# EAGLE design LTC4156Shield (EAGLE 7.4.0)
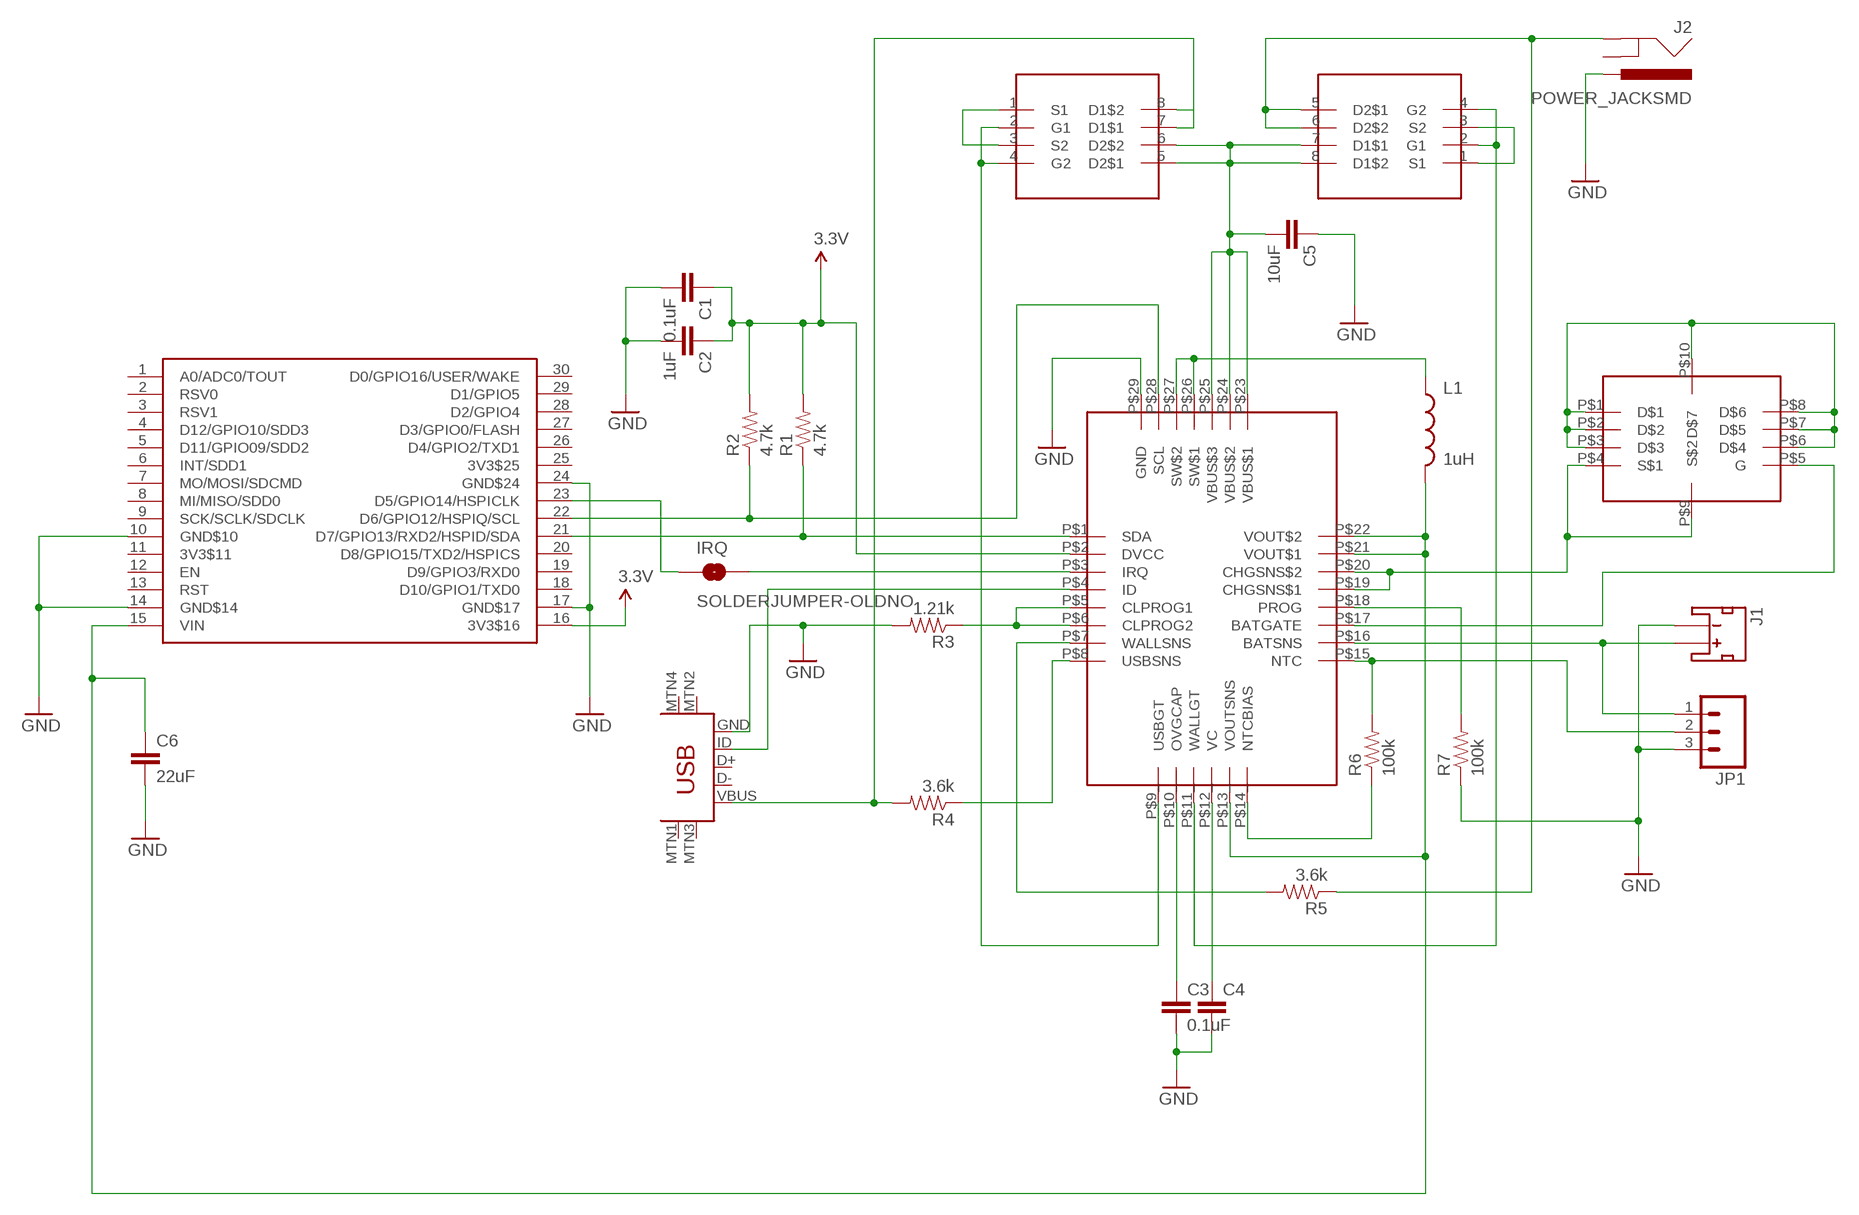
[diagram p0: schematic, sheet 1]

## Parts
C1  0.1uF  CAP0402-CAP  [0402-CAP]
C2  1uF  CAP0402-CAP  [0402-CAP]
C3  0.1uF  CAP0402-CAP  [0402-CAP]
C4  CAP0805  [0805]
C5  10uF  CAP0402-CAP  [0402-CAP]
C6  22uF  CAP0402-CAP  [0402-CAP]
IRQ  SOLDERJUMPER-OLDNO  [SJ_2S-NO]
J1  JST_2MM_MALE  [JST-2-SMD]
J2  POWER_JACKSMD  [POWER_JACK_SMD]
JP1  M03  [JST-3-SMD]
L1  1uH  INDUCTOR0805  [0805]
R1  4.7k  RESISTOR0402-RES  [0402-RES]
R2  4.7k  RESISTOR0402-RES  [0402-RES]
R3  1.21k  RESISTOR0402-RES  [0402-RES]
R4  3.6k  RESISTOR0402-RES  [0402-RES]
R5  3.6k  RESISTOR0402-RES  [0402-RES]
R6  100k  RESISTOR0402-RES  [0402-RES]
R7  100k  RESISTOR0402-RES  [0402-RES]
U$1  NERDSHIELD  [NERDUINO_STACK]
U$2  LTC4156  [QFN28]
U$3  SI7938DP  [SO08]
U$4  USB-MINIB-5PIN  [USB-MINIB]
U$5  SI7938DP  [SO08]
U$6  SI5481  [SI5481]

## Nets
3.3V: C1.1 C2.1 R1.2 R2.2 U$1.16(3V3$16) U$2.P$2(DVCC)
GND: C1.2 C2.2 C3.2 C4.2 C5.1 C6.2 J1.1(-) J2.VIN0(PWR) JP1.3 R3.2 R7.1 U$1.10(GND$10) U$1.14(GND$14) U$1.17(GND$17) U$1.24(GND$24) U$2.P$29(GND) U$4.GND
N$1: R4.1 U$2.P$8(USBSNS)
N$2: R1.1 U$1.21(D7/GPIO13/RXD2/HSPID/SDA) U$2.P$1(SDA)
N$3: IRQ.2 U$2.P$3(IRQ)
N$4: R3.1 U$2.P$5(CLPROG1) U$2.P$6(CLPROG2)
N$5: IRQ.1 U$1.23(D5/GPIO14/HSPICLK)
N$6: U$2.P$4(ID) U$4.ID
N$7: R4.2 U$3.7(D1$1) U$3.8(D1$2) U$4.VBUS
N$8: R2.1 U$1.22(D6/GPIO12/HSPIQ/SCL) U$2.P$28(SCL)
N$9: U$2.P$9_(USBGT) U$3.2(G1) U$3.4(G2)
N$10: C5.2 U$2.P$23(VBUS$1) U$2.P$24(VBUS$2) U$2.P$25(VBUS$3) U$3.5(D2$1) U$3.6(D2$2) U$5.7(D1$1) U$5.8(D1$2)
N$11: R5.2 U$2.P$7(WALLSNS)
N$12: U$3.1(S1) U$3.3(S2)
N$13: U$5.1(S1) U$5.3(S2)
N$14: U$2.P$11_(WALLGT) U$5.2(G1) U$5.4(G2)
N$15: J2.P$4(GND) R5.1 U$5.5(D2$1) U$5.6(D2$2)
N$16: C3.1 U$2.P$10_(OVGCAP)
N$17: C4.1 U$2.P$12_(VC)
N$18: C6.1 L1.2 U$1.15(VIN) U$2.P$13_(VOUTSNS) U$2.P$21(VOUT$1) U$2.P$22(VOUT$2)
N$19: J1.2(+) JP1.1 U$2.P$16(BATSNS)
N$21: L1.1 U$2.P$26(SW$1) U$2.P$27(SW$2)
N$22: JP1.2 R6.2 U$2.P$15(NTC)
N$23: R6.1 U$2.P$14_(NTCBIAS)
N$25: U$2.P$17(BATGATE) U$6.P$5(G)
N$26: U$2.P$19(CHGSNS$1) U$2.P$20(CHGSNS$2) U$6.P$4(S$1) U$6.P$9(S$2)
N$27: U$6.P$1(D$1) U$6.P$2(D$2) U$6.P$3(D$3) U$6.P$6(D$4) U$6.P$7(D$5) U$6.P$8(D$6) U$6.P$10(D$7)
N$28: R7.2 U$2.P$18(PROG)
Unconnected: J1.NC1(PAD1) J1.NC2(PAD2) J2.GND(GNDBREAK) U$1.1(A0/ADC0/TOUT) U$1.2(RSV0) U$1.3(RSV1) U$1.4(D12/GPIO10/SDD3) U$1.5(D11/GPIO09/SDD2) U$1.6(INT/SDD1) U$1.7(MO/MOSI/SDCMD) U$1.8(MI/MISO/SDD0) U$1.9(SCK/SCLK/SDCLK) U$1.11(3V3$11) U$1.12(EN) U$1.13(RST) U$1.18(D10/GPIO1/TXD0) U$1.19(D9/GPIO3/RXD0) U$1.20(D8/GPIO15/TXD2/HSPICS) U$1.25(3V3$25) U$1.26(D4/GPIO2/TXD1) U$1.27(D3/GPIO0/FLASH) U$1.28(D2/GPIO4) U$1.29(D1/GPIO5) U$1.30(D0/GPIO16/USER/WAKE) U$4.D+ U$4.D- U$4.MTN1(MTN2) U$4.MTN2(MTN3) U$4.MTN3(MTN1) U$4.MTN4

## Library data of the parts
C1-C3 C5 C6 = SparkFun:CAP: Capacitor Standard 0603 ceramic capacitor, and 0.1" leaded capacitor.
C4 = SparkFun-Capacitors:CAP: Capacitor Standard 0603 ceramic capacitor, and 0.1" leaded capacitor.
IRQ = SparkFun:SOLDERJUMPER-OLD: Solder Jumper Standard SMD solder jumper. Used to automate production. Two varients : Normally Open and Normally Closed are the same, but have different paste layers. NC will have a large amount of paste and should jumper during reflow.
J1 = SparkFun-Connectors:JST_2MM_MALE: Mates to single-cell LiPo batteries. CONN-11443 Now with smashable polarity marks!; BTM_NEG: -; BTM_POS: +; PROD_ID: CONN-11443; TOP_NEG: -; TOP_POS: +
J2 = SparkFun:POWER_JACK: Power Jack This is the standard 5.5mm barrel jack for power. The PTH is the most common, proven, reliable, footprint. All others are experimental. The Slot footprint only works if the mill layer is transmitted to the PCB fab house so be warned. Spark Fun Electronics SKU : PRT-00119. Mating wall wart : TOL-00298 (and others)
JP1 = SparkFun:M03: Header 3 Standard 3-pin 0.1" header. Use with straight break away headers (SKU : PRT-00116), right angle break away headers (PRT-00553), swiss pins (PRT-00743), machine pins (PRT-00117), and female headers (PRT-00115). Molex polarized connector foot print use with SKU : PRT-08232 with associated crimp pins and housings.
L1 = SparkFun:INDUCTOR: Inductors Basic Inductor/Choke - 0603 and 1206. Footprints are not proven and vary greatly between part numbers.
R1-R7 = SparkFun:RESISTOR: Resistor Basic schematic elements and footprints for 0603, 1206, and PTH resistors.
U$1 = NerduinoShieldLib:NERDSHIELD
U$2 = NerduinoShieldLib:LTC4156
U$3 U$5 = SparkFun-PowerIC:SI7938DP
U$4 = SparkFun:USB-MINIB: Mini-USB "B" connector with 5th pin broken out. Created new symbol breaking out 5th "ID" pin in mini/micro USB connector spec. See: http://en.wikipedia.org/wiki/Mini_usb#Cables. Uses same footprint as 4-pin symbol. Also added pins to connect to mounting / shield pads if required (probably not generally needed as signals aren't shielded once they leave the connector).
U$6 = NerduinoShieldLib:SI5481

## Board
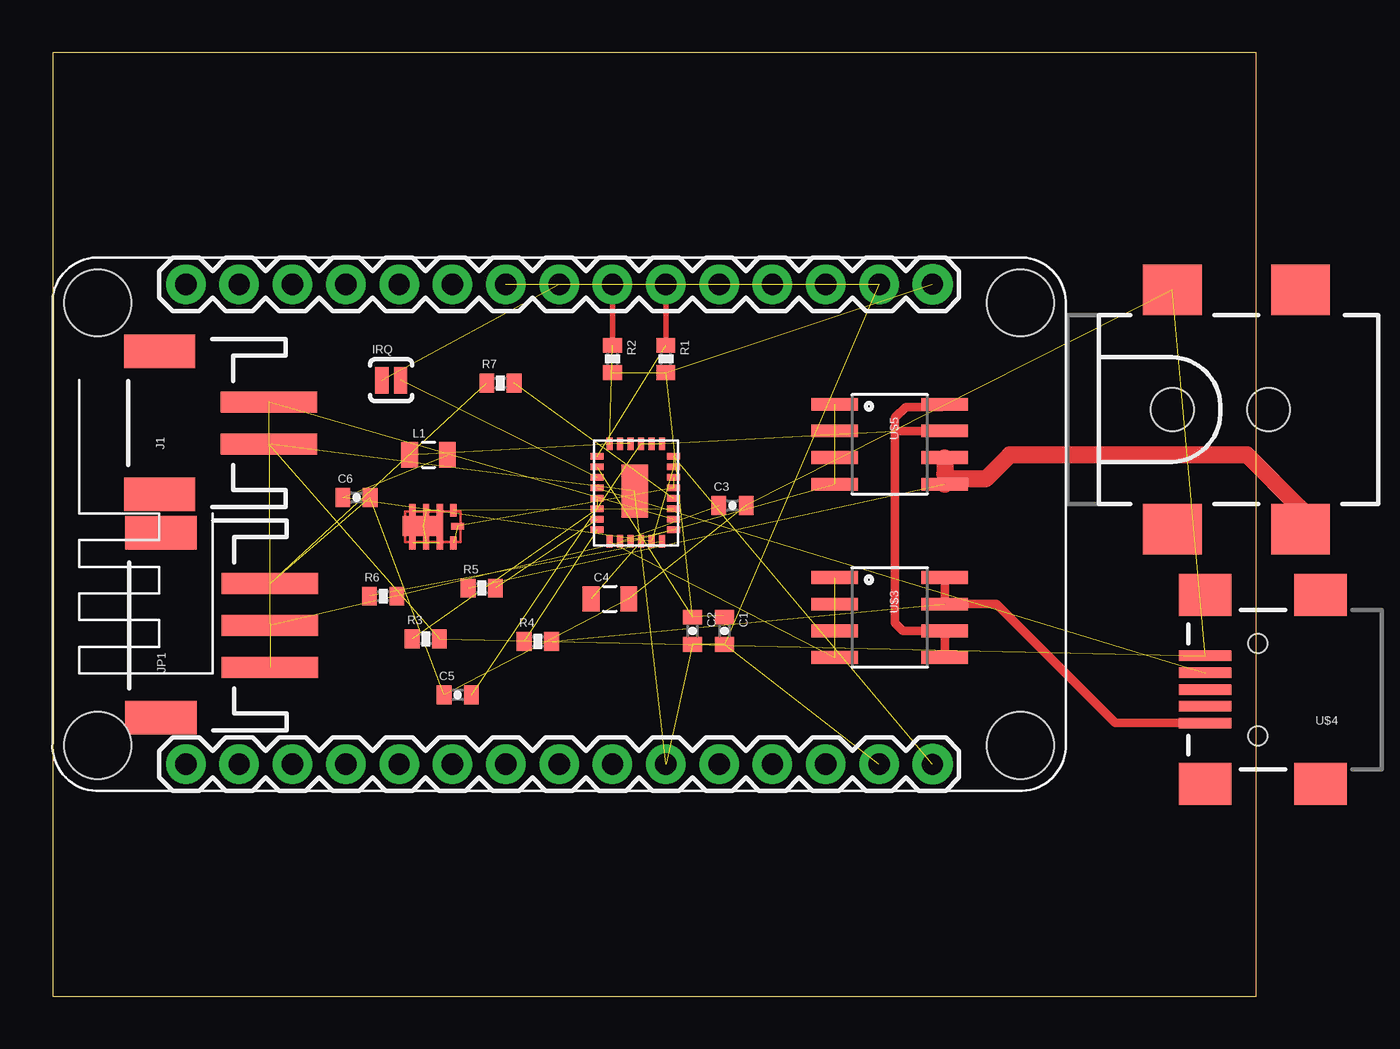
[diagram p1: board, top side]
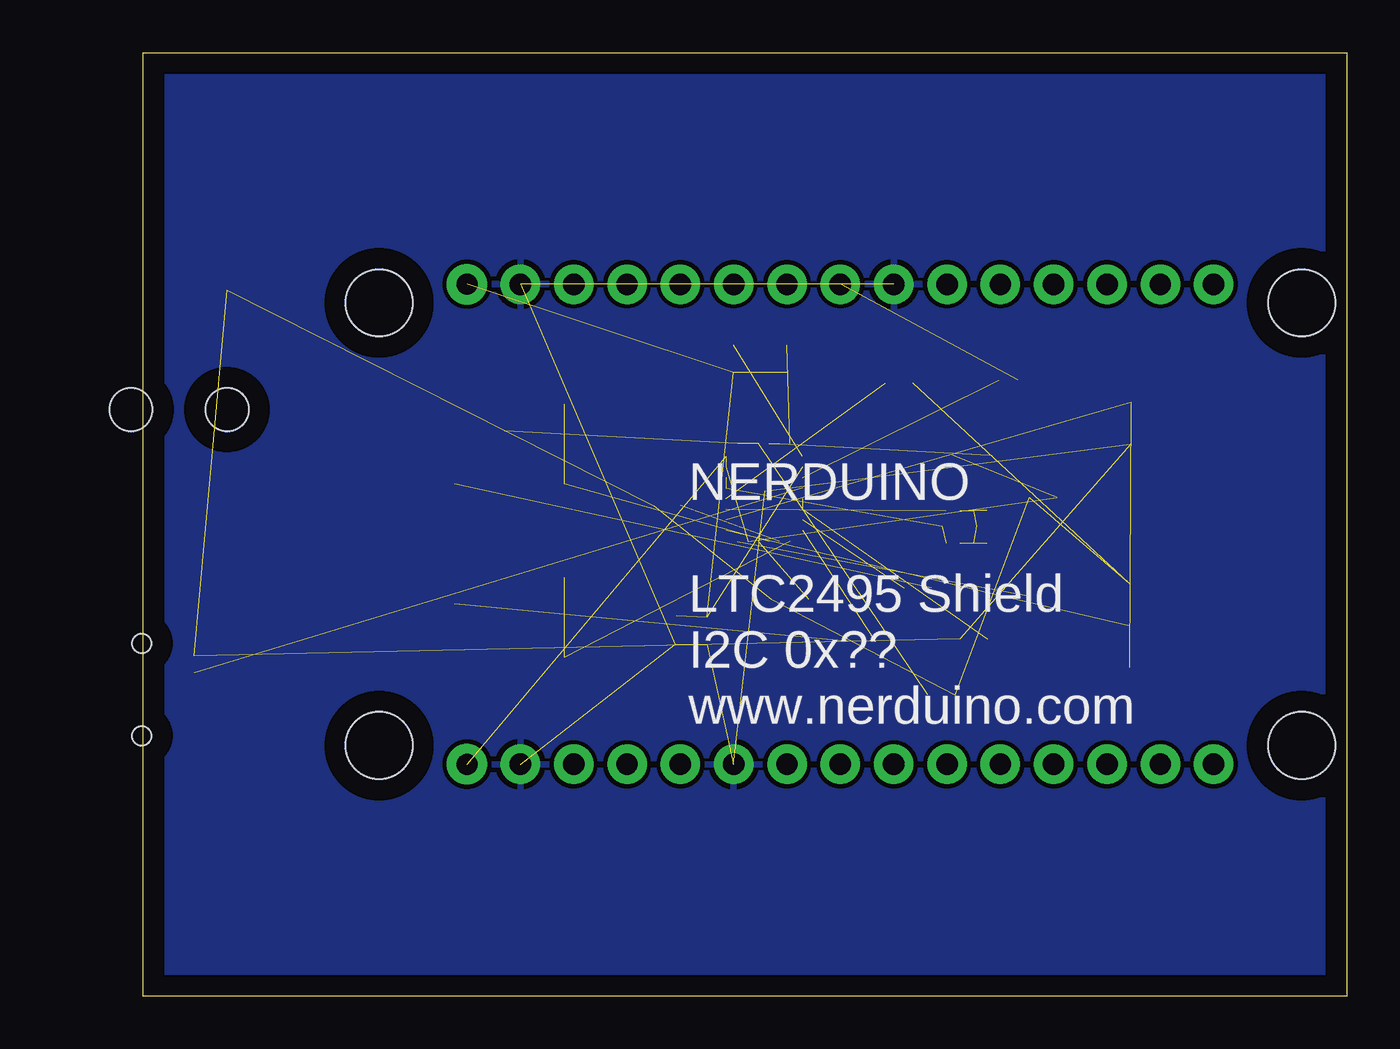
[diagram p2: board, bottom side, seen from below]

Size 57.33 x 44.95 mm. Coordinates in mm from the lower left corner, seen from the top.
Outline: 0,0 57.33,0 57.33,44.95 0,44.95 0,0
Copper layers (1*16): Top 0.035mm / dielectric 1.5mm / Bottom 0.035mm
Design rules "default": minimum track width 10mil, minimum drill 24mil, track to track 8mil, track to pad 8mil, pad to pad 8mil, via to via 8mil, smd to smd 8mil, copper to edge 40mil, drill to drill 8mil, minimum pad ring 10mil, minimum via ring 8mil, stop-mask expansion 4mil, vias tented up to drill 0mil, thermal gap 10mil

### Footprints (pad centres in the part's own frame; a part is rotated, then mirrored left to right if it is on the bottom)
0402-CAP = smd 0.7 x 0.9: 1 -0.65,0; 2 0.65,0
0805 = smd 0.8 x 1.2: 1 -0.9,0; 2 0.9,0
SJ_2S-NO = smd 0.635 x 1.27: 1 -0.45,0; 2 0.45,0
JST-2-SMD = smd 1 x 4.6: 1 -1,-3.7; 2 1,-3.7 | smd 1.6 x 3.4: NC1 -3.4,1.5; NC2 3.4,1.5
POWER_JACK_SMD = smd 2.8 x 2.4: GND 0,-5.7; P$4 6.1,-5.7; VIN0 0,5.7; VIN1 6.1,5.7 | hole 2.032: 0,0; 4.572,0
JST-3-SMD = smd 1 x 4.6: 1 -1.99,-4.77; 2 0.01,-4.77; 3 2.01,-4.77 | smd 1.6 x 3.4: NC1 -4.39,0.43; NC2 4.41,0.43
0402-RES = smd 0.7 x 0.9: 1 -0.65,0; 2 0.65,0
NERDUINO_STACK = drill 1.016 pad 1.88: 1 -17.78,-5.08; 2 -15.24,-5.08; 3 -12.7,-5.08; 4 -10.16,-5.08; 5 -7.62,-5.08; 6 -5.08,-5.08; 7 -2.54,-5.08; 8 0,-5.08; 9 2.54,-5.08; 10 5.08,-5.08; 11 7.62,-5.08; 12 10.16,-5.08; 13 12.7,-5.08; 14 15.24,-5.08; 17 15.24,17.78; 18 12.7,17.78; 19 10.16,17.78; 20 7.62,17.78; 21 5.08,17.78; 22 2.54,17.78; 23 0,17.78; 24 -2.54,17.78; 25 -5.08,17.78; 26 -7.62,17.78; 27 -10.16,17.78; 28 -12.7,17.78; 29 -15.24,17.78; 30 -17.78,17.78 | drill 1 pad 1.93: 15 17.78,-5.08; 16 17.78,17.78 | hole 3.175: -21.971,16.891; -21.971,-4.191; 21.971,-4.191; 21.971,16.891
QFN28 = smd 0.61 x 0.305: P$1 0.15,4.25; P$2 0.15,3.75; P$3 0.15,3.25; P$4 0.15,2.75; P$5 0.15,2.25; P$6 0.15,1.75; P$7 0.15,1.25; P$8 0.15,0.75; P$15 3.8,0.75; P$16 3.8,1.25; P$17 3.8,1.75; P$18 3.8,2.25; P$19 3.8,2.75; P$20 3.8,3.25; P$21 3.8,3.75; P$22 3.8,4.25 | smd 0.305 x 0.61: P$9_ 0.75,0.2; P$10_ 1.25,0.2; P$11_ 1.75,0.2; P$12_ 2.25,0.2; P$13_ 2.75,0.2; P$14_ 3.25,0.2; P$23 3.25,4.85; P$24 2.75,4.85; P$25 2.25,4.85; P$26 1.75,4.85; P$27 1.25,4.85; P$28 0.75,4.85 | smd 1.27 x 2.54: P$29 1.95,2.6
SO08 = smd 0.61 x 2.21: 1 -1.905,-2.616; 2 -0.635,-2.616; 3 0.635,-2.616; 4 1.905,-2.616; 5 1.905,2.616; 6 0.635,2.616; 7 -0.635,2.616; 8 -1.905,2.616
USB-MINIB = smd 2.5 x 0.5: D+ 2.5,0; D- 2.5,0.8; GND 2.5,-1.6; ID 2.5,-0.8; VBUS 2.5,1.6 | smd 2.5 x 2: MTN1 -3,4.5; MTN2 2.5,4.5; MTN3 -3,-4.5; MTN4 2.5,-4.5 | hole 0.9: 0,2.2; 0,-2.2
SI5481 = smd 0.305 x 0.61: P$1 0,0; P$2 0.65,0; P$3 1.3,0; P$4 1.95,0; P$5 1.95,1.55; P$6 1.3,1.55; P$7 0.65,1.55; P$8 0,1.55 | smd 0.61 x 0.305: P$9 2.15,0.8 | smd 1.93 x 0.965: P$10 0.5,0.8

### Placement (x,y rotation side)
C1  32,17.4 270 top
C2  30.48,17.4 270 top
C3  32.38,23.37 0 top
C4  26.54,18.92 0 top
C5  19.3,14.35 0 top
C6  14.48,23.75 0 top
IRQ  16.13,29.34 0 top
J1  6.6,27.3 90 top
J2  53.34,27.94 0 top
JP1  5.59,17.65 90 top
L1  17.91,25.78 0 top
R1  29.21,30.35 270 top
R2  26.67,30.35 270 top
R3  17.78,17.02 0 top
R4  23.11,16.89 0 top
R5  20.45,19.43 0 top
R6  15.75,19.05 0 top
R7  21.34,29.21 0 top
U$1  24.13,16.13 0 top
U$2  25.78,21.46 0 top
U$3  39.88,18.03 270 top
U$4  57.4,14.61 180 top
U$5  39.88,26.29 270 top
U$6  17.14,21.59 0 top

### Tracks (layer width: path | path; a pad name or v marks a point on that pad's centre or on a via)
3.3V  (5 unrouted)
  Top 0.254: R1.2 29.21,29.72 | 31.93,18.12 C1.1
GND  (16 unrouted)
  pour Bottom: 0.25,44.83 57.02,44.7 57.02,0.25 0.25,0.38
N$1  (1 unrouted)
N$2  (1 unrouted)
  Top 0.254: U$1.21 R1.1
N$3  (1 unrouted)
N$4  (2 unrouted)
N$5  (1 unrouted)
N$6  (1 unrouted)
N$7  (1 unrouted)
  Top 0.406: U$4.VBUS 50.62,13 44.96,18.67 U$3.7 U$3.8
N$8  (1 unrouted)
  Top 0.254: R2.1 U$1.22
N$9  (2 unrouted)
N$10  (4 unrouted)
  Top 0.406: U$3.5 U$3.6 40.51,17.4 40.13,17.78 40.13,26.92 | 40.13,26.92 40.13,27.56 40.64,28.07 42.37,28.07 U$5.8 | U$5.7 40.13,26.92
N$11  (1 unrouted)
N$12  (1 unrouted)
N$13  (1 unrouted)
N$14  (2 unrouted)
N$15  (1 unrouted)
  Top 0.813: J2.P$4 59.44,23.24 56.9,25.78 45.59,25.78 44.45,24.64 42.75,24.64 | 42.75,24.64 U$5.5 | U$5.6 42.49,24.89 42.75,24.64
N$16  (1 unrouted)
N$17  (1 unrouted)
N$18  (5 unrouted)
N$19  (2 unrouted)
N$21  (2 unrouted)
N$22  (2 unrouted)
N$23  (1 unrouted)
N$25  (1 unrouted)
N$26  (3 unrouted)
N$27  (6 unrouted)
N$28  (1 unrouted)

### Text on the board
_bsilk: NERDUINO / / LTC2495 Shield / I2C 0x?? / www.nerduino.com